# Altium schematic sheet face_board.SchDoc
size A3
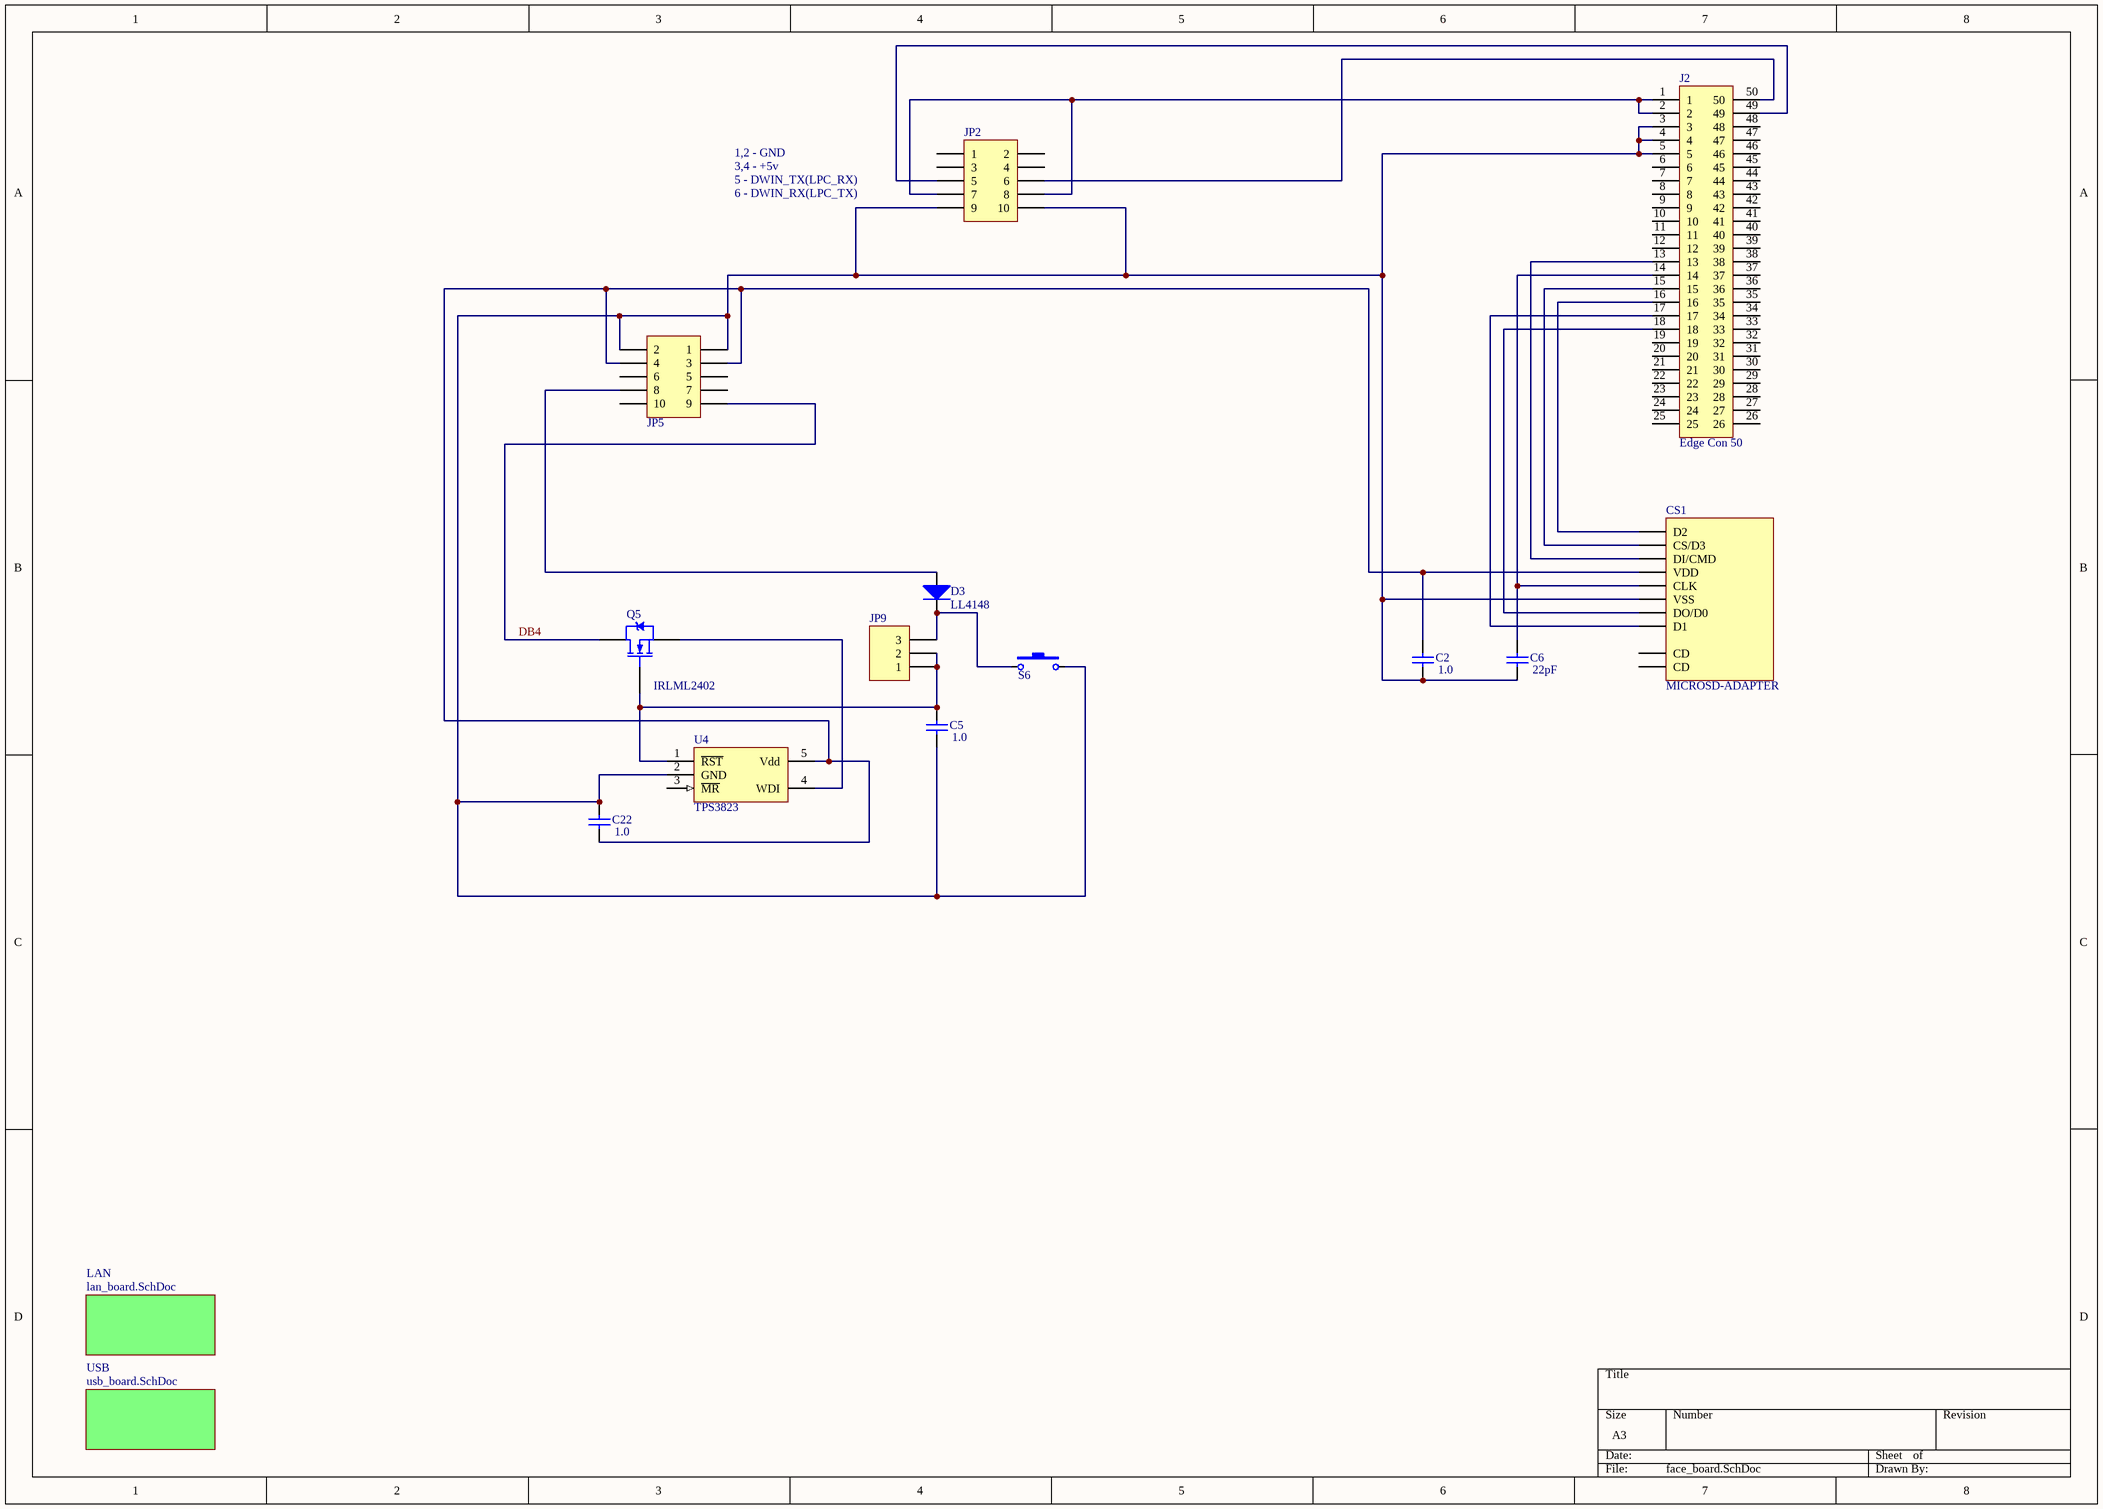
[diagram p0: face_board.SchDoc]

## Parts
C2  1.0  [_0603]
C5  1.0  [_0603]
C6  22pF  [_0603]
C22  1.0  [_0603]
CS1  MICROSD-ADAPTER  [microsd_2]
D3  LL4148  [_1206d]
J2  Edge Con 50  [FH12-50]
JP2  PBD-10  [HDR2X5]  (value not drawn)
JP5  PLHD-20  [HDR2X5]  (value not drawn)
JP9  PLS-3  [HDR1X3]  (value not drawn)
Q5  IRLML2402  [SO-G3]
S6  SWT-6  [SWT-6]  (value not drawn)
U4  TPS3823  [SO-G5/P.95]

## Sub-sheets
LAN = lan_board.SchDoc: no entries
USB = usb_board.SchDoc: no entries

## Nets
DB4: JP5.9 Q5.3(D)
NetC2_1: C2.1 C5.1 C6.1 C22.2 CS1.6(VSS) J2.3 J2.4 J2.5 JP2.9 JP2.10 JP5.1 JP5.2 S6.2 U4.2(GND)
NetC2_2: C2.2 C22.1 CS1.4(VDD) JP5.3 JP5.4 U4.5(Vdd)
NetC5_2: C5.2 JP9.1 JP9.2 Q5.1(G) U4.1(~{RST})
NetC6_2: C6.2 CS1.5(CLK) J2.14
NetCS1_1: CS1.1(D2) J2.16
NetCS1_2: CS1.2(CS/D3) J2.15
NetCS1_3: CS1.3(DI/CMD) J2.13
NetCS1_7: CS1.7(DO/D0) J2.18
NetCS1_8: CS1.8(D1) J2.17
NetD3_1: D3.1(A) JP5.8
NetD3_2: D3.2(K) JP9.3 S6.1
NetJ2_1: J2.1 J2.2 JP2.7 JP2.8
NetJ2_49: J2.49 JP2.5
NetJ2_50: J2.50 JP2.6
NetQ5_2: Q5.2(S) U4.4(WDI)

Not connected (* = marked no-connect by the designer): CS1 9(CD) 10(CD); J2 6 7 8 9 10 11 12 19 20 21 22 23 24 25 26 27 28 29 30 31 32 33 34 35 36 37 38 39 40 41 42 43 44 45 46 47 48; JP2 1 2 3 4; JP5 5 6 7 10; U4 3(~{MR})

## Notes on the sheet
- 1,2 - GND
- 3,4 - +5v
- 5 - DWIN_TX(LPC_RX)
- 6 - DWIN_RX(LPC_TX)

## Library data of the parts
C2 C5 C22 = Cap Semi: Capacitor; Manufacturer: Generic Components; Class I: Passive; Value: 0,1; Published: 8-Jun-2000; Revision: July-2002: Re-released for DXP Platform.; Publisher: Altium Limited; Class II: Capacitor
C6 = Cap Semi: Capacitor; Manufacturer: Generic Components; Class I: Passive; Published: 8-Jun-2000; Revision: July-2002: Re-released for DXP Platform.; Publisher: Altium Limited; Class II: Capacitor; Value: 22pF
D3 = Diode: Manufacturer: Generic Components; Class I: Discrete; Class II: Diode - Switching; Published: 8-Jun-2000; Revision: July-2002: Re-released for DXP Platform.; Publisher: Altium Limited; Value: LL4148
J2 = Edge Con 50: 50-Pin Edge Connector; Manufacturer: Generic Components; Revision: July-2002: Re-released for DXP Platform.; Publisher: Altium Limited; Class I: Connector
JP2 JP5 = Header 5X2: Header, 5-Pin, Dual row; Manufacturer: Generic Components; Class I: Connector; Revision: July-2002: Re-released for DXP Platform.; Publisher: Altium Limited
JP9 = Header 3: Header, 3-Pin; Manufacturer: Generic Components; Class I: Connector; Revision: July-2002: Re-released for DXP Platform.; Publisher: Altium Limited
Q5 = IRLML2402: HEXFET Power MOSFET; Manufacturer: International Rectifier; Class I: Discrete; Class II: MOSFET - Power; Published: 8-Jun-2000; Revision: July-2002: Re-released for DXP Platform.; Datasheet: Latest Revision: Aug-1997; Package Reference: SOT-23; Publisher: Altium Limited; Value: IRLML2402
S6 = SWT-9: Button; Manufacturer: Generic Components; Published: 24-Mar-1999; Revision: July-2002: Re-released for DXP Platform.; Publisher: Altium Limited; Value: SWT-6
U4 = TPS3823: Reset IC; Manufacturer: National Semiconductor; Package Information: Latest Revision: Aug-1999; Class I: Power Management; Class II: Voltage Regulator; Value: TPS76333; Published: 15-Apr-2002; Datasheet: Latest Revision: Oct-1999; Package Reference: MA05B; Publisher: Altium Limited